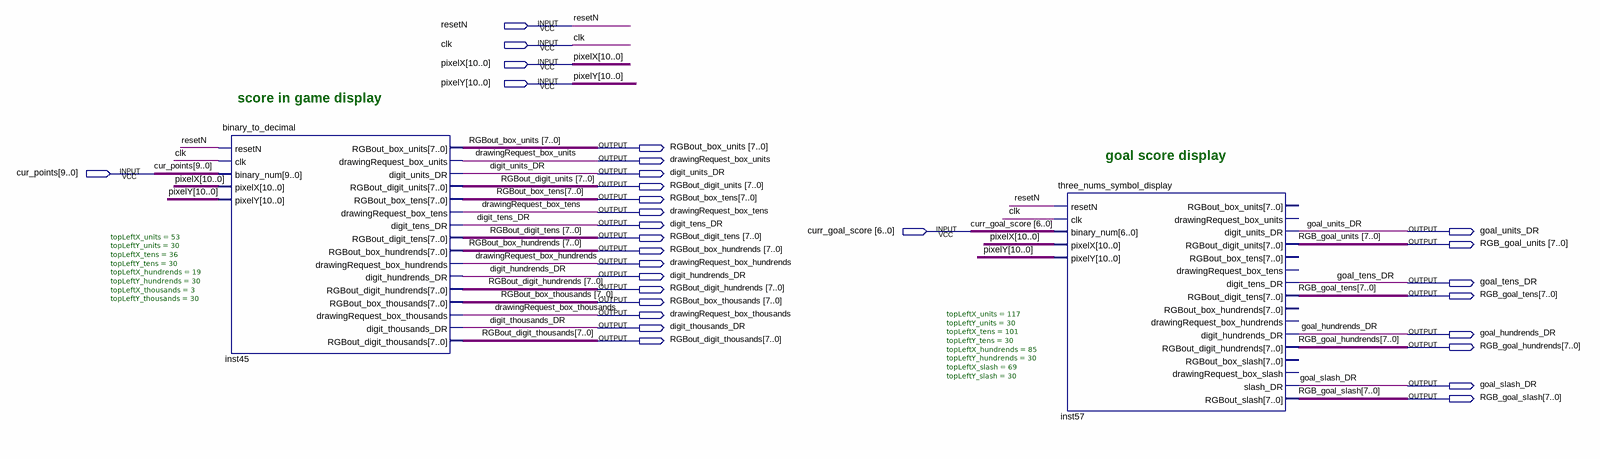
[diagram p0: schematic sheet]
// Quartus schematic score_and_goal_displays.bdf as structural Verilog: 2 symbols, 30 pins
module score_and_goal_displays (
  input  resetN,
  input  clk,
  input  [10:0] pixelX,
  input  [10:0] pixelY,
  input  [9:0] cur_points,
  input  [6:0] curr_goal_score,
  output [7:0] RGBout_box_units,
  output drawingRequest_box_units,
  output digit_units_DR,
  output [7:0] RGBout_digit_units,
  output [7:0] RGBout_box_tens,
  output drawingRequest_box_tens,
  output digit_tens_DR,
  output goal_units_DR,
  output [7:0] RGBout_digit_tens,
  output [7:0] RGB_goal_units,
  output [7:0] RGBout_box_hundrends,
  output drawingRequest_box_hundrends,
  output digit_hundrends_DR,
  output goal_tens_DR,
  output [7:0] RGBout_digit_hundrends,
  output [7:0] RGB_goal_tens,
  output [7:0] RGBout_box_thousands,
  output drawingRequest_box_thousands,
  output digit_thousands_DR,
  output goal_hundrends_DR,
  output [7:0] RGBout_digit_thousands,
  output [7:0] RGB_goal_hundrends,
  output goal_slash_DR,
  output [7:0] RGB_goal_slash
);

  binary_to_decimal #(.topLeftX_units(53), .topLeftY_units(30), .topLeftX_tens(36), .topLeftY_tens(30), .topLeftX_hundrends(19), .topLeftY_hundrends(30), .topLeftX_thousands(3), .topLeftY_thousands(30)) inst45 (
    .resetN(resetN), .clk(clk), .binary_num(cur_points), .pixelX(pixelX), .pixelY(pixelY),
    .RGBout_box_units(RGBout_box_units), .drawingRequest_box_units(drawingRequest_box_units),
    .digit_units_DR(digit_units_DR), .RGBout_digit_units(RGBout_digit_units),
    .RGBout_box_tens(RGBout_box_tens), .drawingRequest_box_tens(drawingRequest_box_tens),
    .digit_tens_DR(digit_tens_DR), .RGBout_digit_tens(RGBout_digit_tens),
    .RGBout_box_hundrends(RGBout_box_hundrends), .drawingRequest_box_hundrends(drawingRequest_box_hundrends),
    .digit_hundrends_DR(digit_hundrends_DR), .RGBout_digit_hundrends(RGBout_digit_hundrends),
    .RGBout_box_thousands(RGBout_box_thousands), .drawingRequest_box_thousands(drawingRequest_box_thousands),
    .digit_thousands_DR(digit_thousands_DR), .RGBout_digit_thousands(RGBout_digit_thousands));
  three_nums_symbol_display #(.topLeftX_units(117), .topLeftY_units(30), .topLeftX_tens(101), .topLeftY_tens(30), .topLeftX_hundrends(85), .topLeftY_hundrends(30), .topLeftX_slash(69), .topLeftY_slash(30)) inst57 (
    .resetN(resetN), .clk(clk), .binary_num(curr_goal_score), .pixelX(pixelX), .pixelY(pixelY),
    .digit_units_DR(goal_units_DR), .RGBout_digit_units(RGB_goal_units), .digit_tens_DR(goal_tens_DR),
    .RGBout_digit_tens(RGB_goal_tens), .digit_hundrends_DR(goal_hundrends_DR),
    .RGBout_digit_hundrends(RGB_goal_hundrends), .slash_DR(goal_slash_DR), .RGBout_slash(RGB_goal_slash));  // open: RGBout_box_units, drawingRequest_box_units, RGBout_box_tens, drawingRequest_box_tens, RGBout_box_hundrends, drawingRequest_box_hundrends, RGBout_box_slash, drawingRequest_box_slash

  // Notes on the sheet:
  //   score in game display
  //   goal score display
endmodule
